# EAGLE design DualExpVCA (EAGLE 9.6.0)
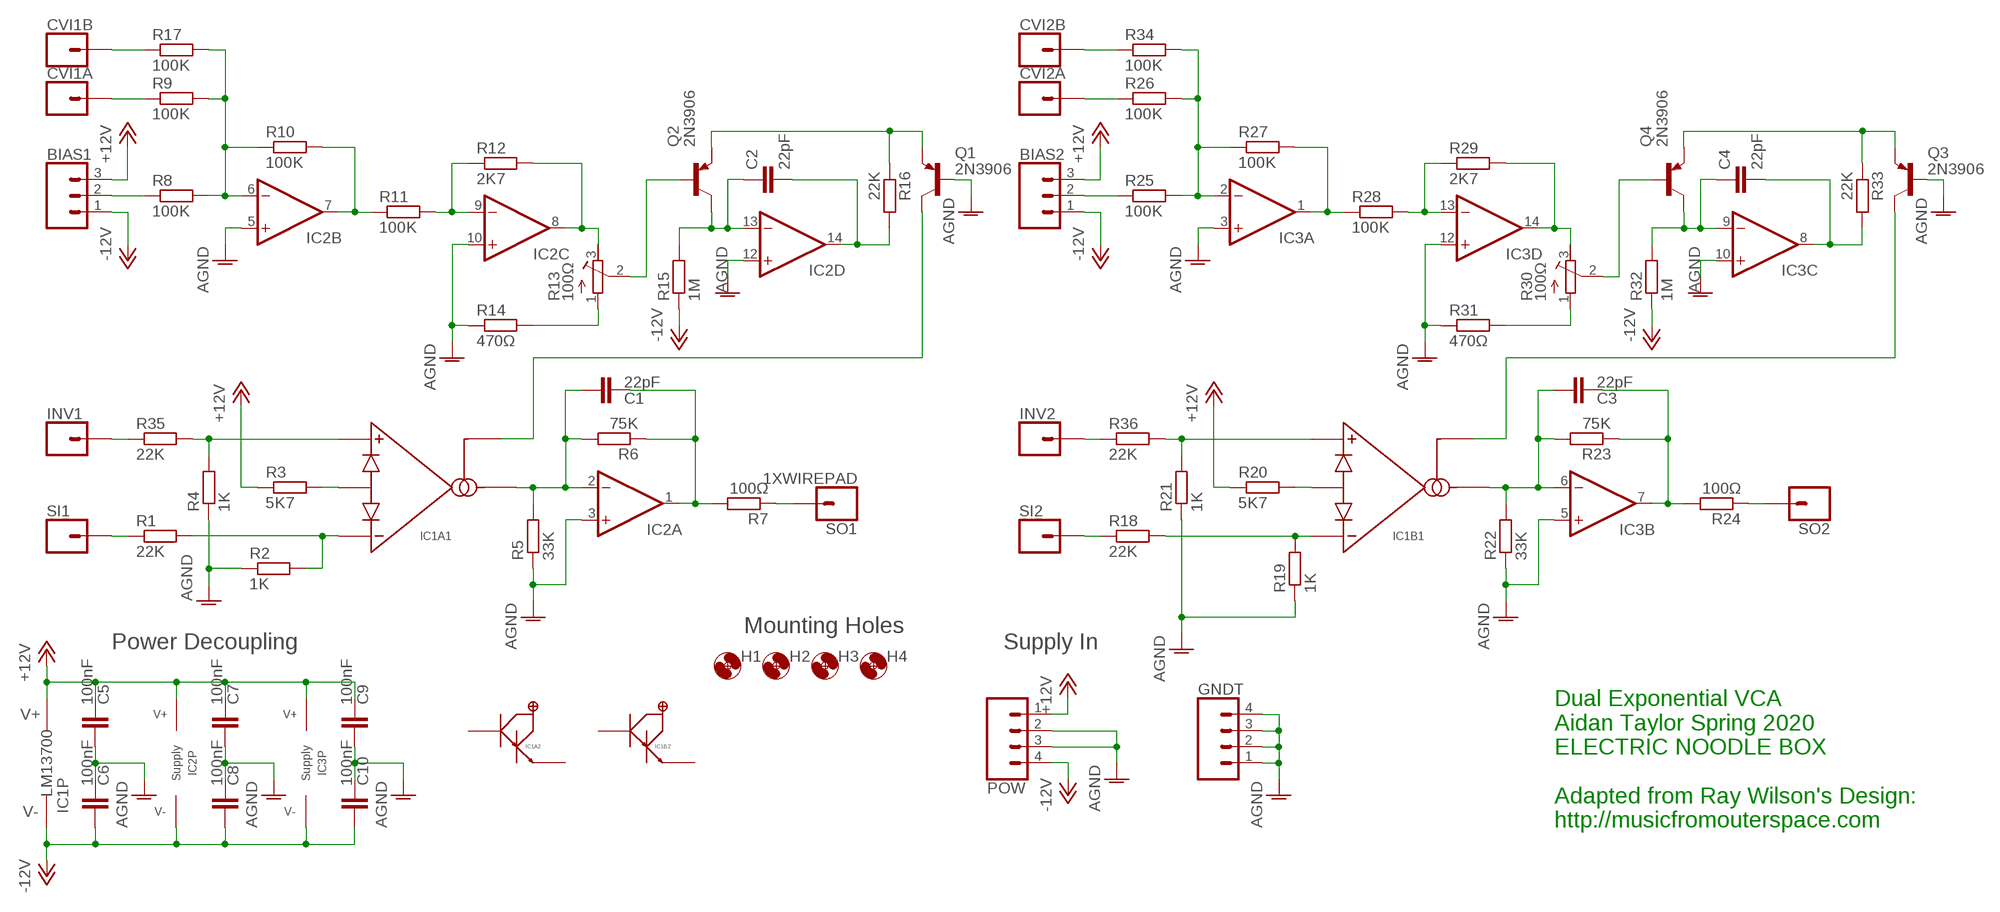
[diagram p0: schematic, sheet 1]

## Parts
BIAS1  3XWIREPAD  [1X03]
BIAS2  3XWIREPAD  [1X03]
C1  22pF  C-EU050-025X075  [C050-025X075]
C2  22pF  C-EU050-025X075  [C050-025X075]
C3  22pF  C-EU050-025X075  [C050-025X075]
C4  22pF  C-EU050-025X075  [C050-025X075]
C5  100nF  C-EU050-025X075  [C050-025X075]
C6  100nF  C-EU050-025X075  [C050-025X075]
C7  100nF  C-EU050-025X075  [C050-025X075]
C8  100nF  C-EU050-025X075  [C050-025X075]
C9  100nF  C-EU050-025X075  [C050-025X075]
C10  100nF  C-EU050-025X075  [C050-025X075]
CVI1A  1XWIREPAD  [1X01]
CVI1B  1XWIREPAD  [1X01]
CVI2A  1XWIREPAD  [1X01]
CVI2B  1XWIREPAD  [1X01]
GNDT  4XWIREPAD  [1X04]
H1  MOUNT-HOLE3.2  [3,2]
H2  MOUNT-HOLE3.2  [3,2]
H3  MOUNT-HOLE3.2  [3,2]
H4  MOUNT-HOLE3.2  [3,2]
IC1  LM13700_DIP  [DIL16]
IC2  TL0X4_DIP  [DIL14]
IC3  TL0X4_DIP  [DIL14]
INV1  1XWIREPAD  [1X01]
INV2  1XWIREPAD  [1X01]
POW  4XMOLEX  [MOLEX-1X4]
Q1  2N3906  [TO92]
Q2  2N3906  [TO92]
Q3  2N3906  [TO92]
Q4  2N3906  [TO92]
R1  22K  R-EU_0207/10  [0207/10]
R2  1K  R-EU_0207/10  [0207/10]
R3  5K7  R-EU_0207/10  [0207/10]
R4  1K  R-EU_0207/10  [0207/10]
R5  33K  R-EU_0207/10  [0207/10]
R6  75K  R-EU_0207/10  [0207/10]
R7  100Ω  R-EU_0207/10  [0207/10]
R8  100K  R-EU_0207/10  [0207/10]
R9  100K  R-EU_0207/10  [0207/10]
R10  100K  R-EU_0207/10  [0207/10]
R11  100K  R-EU_0207/10  [0207/10]
R12  2K7  R-EU_0207/10  [0207/10]
R13  100Ω  R-TRIMM3296W  [RTRIM3296W]
R14  470Ω  R-EU_0207/10  [0207/10]
R15  1M  R-EU_0207/10  [0207/10]
R16  22K  R-EU_0207/10  [0207/10]
R17  100K  R-EU_0207/10  [0207/10]
R18  22K  R-EU_0207/10  [0207/10]
R19  1K  R-EU_0207/10  [0207/10]
R20  5K7  R-EU_0207/10  [0207/10]
R21  1K  R-EU_0207/10  [0207/10]
R22  33K  R-EU_0207/10  [0207/10]
R23  75K  R-EU_0207/10  [0207/10]
R24  100Ω  R-EU_0207/10  [0207/10]
R25  100K  R-EU_0207/10  [0207/10]
R26  100K  R-EU_0207/10  [0207/10]
R27  100K  R-EU_0207/10  [0207/10]
R28  100K  R-EU_0207/10  [0207/10]
R29  2K7  R-EU_0207/10  [0207/10]
R30  100Ω  R-TRIMM3296W  [RTRIM3296W]
R31  470Ω  R-EU_0207/10  [0207/10]
R32  1M  R-EU_0207/10  [0207/10]
R33  22K  R-EU_0207/10  [0207/10]
R34  100K  R-EU_0207/10  [0207/10]
R35  22K  R-EU_0207/10  [0207/10]
R36  22K  R-EU_0207/10  [0207/10]
SI1  1XWIREPAD  [1X01]
SI2  1XWIREPAD  [1X01]
SO1  1XWIREPAD  [1X01]
SO2  1XWIREPAD  [1X01]

## Nets
+12V: BIAS1.3 BIAS2.3 C5.2 C7.2 C9.2 IC1.11(P:V+) IC2.4(P:V+) IC3.4(P:V+) POW.1 R3.1 R20.1
-12V: BIAS1.1 BIAS2.1 C6.1 C8.1 C10.1 IC1.6(P:V-) IC2.11(P:V-) IC3.11(P:V-) POW.4 R15.1 R32.1
AGND: C5.1 C6.2 C7.1 C8.2 C9.1 C10.2 GNDT.1 GNDT.2 GNDT.3 GNDT.4 IC2.3(A:+IN) IC2.5(B:+IN) IC2.10(C:+IN) IC2.12(D:+IN) IC3.3(A:+IN) IC3.5(B:+IN) IC3.10(C:+IN) IC3.12(D:+IN) POW.2 POW.3 Q1.2(B) Q3.2(B) R2.1 R4.1 R5.1 R14.1 R19.1 R21.1 R22.1 R31.1
N$1: R1.1 SI1.1
N$2: IC1.3(A1:AMP+) R4.2 R35.2
N$3: BIAS1.2 R8.1
N$4: IC1.4(A1:AMP-) R1.2 R2.2
N$5: IC1.2(A1:DIODES) R3.2
N$6: R7.1 SO1.1
N$7: C1.1 IC1.5(A1:AMPOUT) IC2.2(A:-IN) R5.2 R6.2
N$8: C1.2 IC2.1(A:OUT) R6.1 R7.2
N$9: CVI1A.1 R9.1
N$10: IC2.6(B:-IN) R8.2 R9.2 R10.1 R17.2
N$11: IC2.7(B:OUT) R10.2 R11.1
N$12: IC2.9(C:-IN) R11.2 R12.1
N$13: IC2.8(C:OUT) R12.2 R13.3(E)
N$14: R13.1(A) R14.2
N$15: Q2.2(B) R13.2(S)
N$16: C2.1 IC2.13(D:-IN) Q2.1(C) R15.2
N$17: Q1.3(E) Q2.3(E) R16.1
N$18: C2.2 IC2.14(D:OUT) R16.2
N$19: CVI1B.1 R17.1
N$20: IC1.1(A1:AMPBIAS) Q1.1(C)
N$21: R18.1 SI2.1
N$22: IC1.14(B1:AMP+) R21.2 R36.2
N$23: IC1.13(B1:AMP-) R18.2 R19.2
N$24: IC1.15(B1:DIODES) R20.2
N$25: C3.1 IC1.12(B1:AMPOUT) IC3.6(B:-IN) R22.2 R23.2
N$26: C3.2 IC3.7(B:OUT) R23.1 R24.2
N$27: R24.1 SO2.1
N$28: BIAS2.2 R25.1
N$29: CVI2A.1 R26.1
N$30: IC3.2(A:-IN) R25.2 R26.2 R27.1 R34.2
N$31: IC3.1(A:OUT) R27.2 R28.1
N$32: IC3.13(D:-IN) R28.2 R29.1
N$33: IC3.14(D:OUT) R29.2 R30.3(E)
N$34: R30.1(A) R31.2
N$35: C4.1 IC3.9(C:-IN) Q4.1(C) R32.2
N$36: C4.2 IC3.8(C:OUT) R33.2
N$37: Q3.3(E) Q4.3(E) R33.1
N$38: IC1.16(B1:AMPBIAS) Q3.1(C)
N$39: Q4.2(B) R30.2(S)
N$40: CVI2B.1 R34.1
N$41: INV1.1 R35.1
N$42: INV2.1 R36.1
Unconnected: IC1.7(A2:BUFF_IN) IC1.8(A2:BUFF_OUT) IC1.9(B2:BUFF_OUT) IC1.10(B2:BUFF_IN)

## Notes on the sheet
- Mounting Holes
- Power Decoupling | Supply In
- Dual Exponential VCA
  Aidan Taylor Spring 2020
  ELECTRIC NOODLE BOX
  
  Adapted from Ray Wilson's Design:
  http://musicfromouterspace.com

## Library data of the parts
BIAS1 BIAS2 = ElectricNoodleBox:3XWIREPAD
C1-C10 = rcl:C-EU: CAPACITOR, European symbol; SPICEPREFIX: C
CVI1A CVI1B CVI2A CVI2B INV1 INV2 SI1 SI2 SO1 SO2 = ElectricNoodleBox:1XWIREPAD
GNDT = ElectricNoodleBox:4XWIREPAD
H1-H4 = holes:MOUNT-HOLE: MOUNTING HOLE with drill center marker
IC1 = ElectricNoodleBox:LM13700_DIP
IC2 IC3 = ElectricNoodleBox:TL0X4_DIP
POW = ElectricNoodleBox:4XMOLEX
Q1-Q4 = transistor-pnp:2N3906: PNP Transistor
R1-R12 R14-R29 R31-R36 = rcl:R-EU_: RESISTOR, European symbol; SPICEPREFIX: R
R13 R30 = rcl:R-TRIMM: Trimm resistor; SPICEMODEL: X; SPICEPREFIXL: POT

## Board
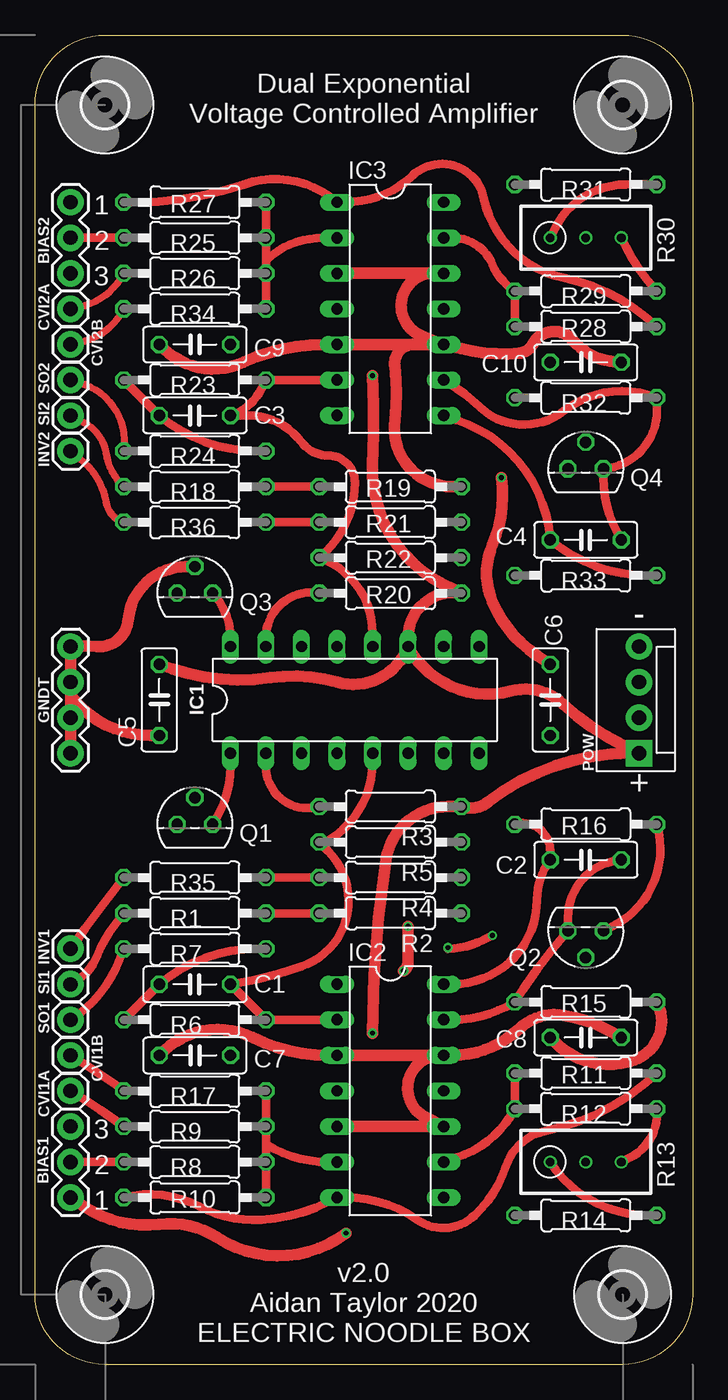
[diagram p1: board, top side]
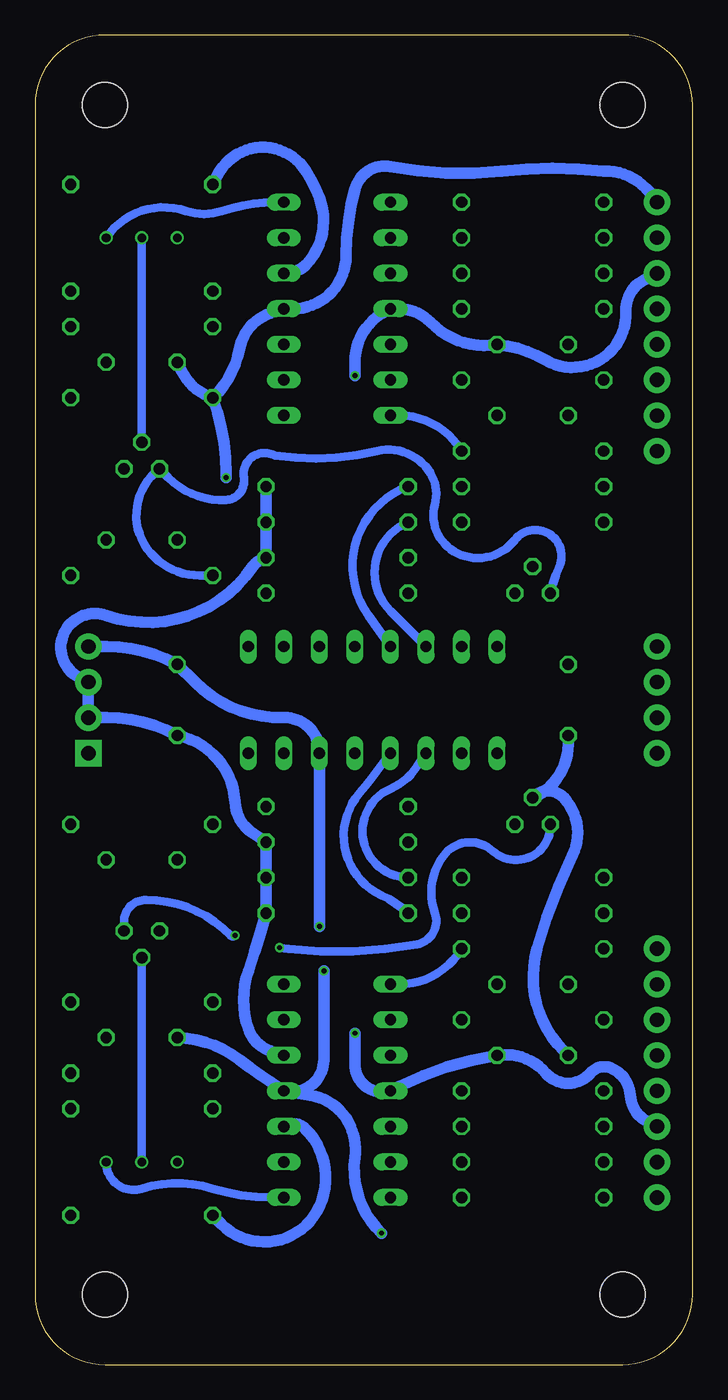
[diagram p2: board, bottom side, seen from below]

Size 47 x 95 mm. Coordinates in mm from the lower left corner, seen from the top.
Outline: 47,90 47,5 arc-90 42,0 5,0 arc-90 0,5 0,90 arc-90 5,95 42,95 arc-90 47,90
Copper layers (1*16): Top 0.035mm / dielectric 1.6mm / Bottom 0.035mm
Design rules "Elecrow_2-layer_PCB_eagle_rule": minimum track width 6mil, minimum drill 12mil, track to track 6mil, track to pad 6mil, pad to pad 6mil, via to via 8mil, smd to smd 0mil, copper to edge 20mil, drill to drill 10mil, minimum pad ring 6mil, minimum via ring 6mil, stop-mask expansion 0mil, vias tented up to drill 100mil, thermal gap 10mil

### Footprints (pad centres in the part's own frame; a part is rotated, then mirrored left to right if it is on the bottom)
1X03 = drill 1.016 pad 1.88: 1 0,0; 2 2.54,0; 3 5.08,0
C050-025X075 = drill 0.813 octagon: 1 -2.54,0; 2 2.54,0
1X01 = drill 1.016 pad 1.88: 1 0,0
1X04 = drill 1.016 pad 1.88: 1 0,0; 2 2.54,0; 3 5.08,0; 4 7.62,0
3,2 = hole 3.2: 0,0
DIL16 = drill 0.813 long: 1 -8.89,-3.81; 2 -6.35,-3.81; 3 -3.81,-3.81; 4 -1.27,-3.81; 5 1.27,-3.81; 6 3.81,-3.81; 7 6.35,-3.81; 8 8.89,-3.81; 9 8.89,3.81; 10 6.35,3.81; 11 3.81,3.81; 12 1.27,3.81; 13 -1.27,3.81; 14 -3.81,3.81; 15 -6.35,3.81; 16 -8.89,3.81
DIL14 = drill 0.813 long: 1 -7.62,-3.81; 2 -5.08,-3.81; 3 -2.54,-3.81; 4 0,-3.81; 5 2.54,-3.81; 6 5.08,-3.81; 7 7.62,-3.81; 8 7.62,3.81; 9 5.08,3.81; 10 2.54,3.81; 11 0,3.81; 12 -2.54,3.81; 13 -5.08,3.81; 14 -7.62,3.81
MOLEX-1X4 = drill 1.016 pad 1.88 square: 1 0,0 | drill 1.016 pad 1.88: 2 2.54,0; 3 5.08,0; 4 7.62,0
TO92 = drill 0.813 octagon: 1 1.27,0; 2 0,1.905; 3 -1.27,0
0207/10 = drill 0.813 octagon: 1 -5.08,0; 2 5.08,0
RTRIM3296W = drill 0.61: 1 0,-2.54; 2 0,0; 3 0,2.54

### Placement (x,y rotation side)
BIAS1  2.54,11.93 90 top
BIAS2  2.54,83.05 270 top
C1  11.43,27.17 180 top
C2  39.37,36.06 180 top
C3  11.43,67.81 180 top
C4  39.37,58.92 180 top
C5  8.89,47.49 90 top
C6  36.83,47.49 270 top
C7  11.43,22.09 0 top
C8  39.37,23.36 0 top
C9  11.43,72.89 0 top
C10  39.37,71.62 0 top
CVI1A  2.54,19.55 0 top
CVI1B  2.54,22.09 0 top
CVI2A  2.54,75.43 0 top
CVI2B  2.54,72.89 0 top
GNDT  2.54,43.68 90 top
H1  42,5 0 top
H2  5,5 0 top
H3  42,90 0 top
H4  5,90 0 top
IC1  22.86,47.49 0 top
IC2  25.4,19.55 270 top
IC3  25.4,75.43 270 top
INV1  2.54,29.71 0 top
INV2  2.54,65.27 0 top
POW  43.18,43.68 90 top
Q1  11.43,38.6 0 top
Q2  39.37,30.98 180 top
Q3  11.43,55.11 0 top
Q4  39.37,64 0 top
R1  11.43,32.25 0 top
R2  25.4,32.25 180 top
R3  25.4,39.87 180 top
R4  25.4,34.79 180 top
R5  25.4,37.33 180 top
R6  11.43,24.63 0 top
R7  11.43,29.71 0 top
R8  11.43,14.47 0 top
R9  11.43,17.01 0 top
R10  11.43,11.93 180 top
R11  39.37,20.82 180 top
R12  39.37,18.28 0 top
R13  39.37,14.47 270 top
R14  39.37,10.66 0 top
R15  39.37,25.9 180 top
R16  39.37,38.6 180 top
R17  11.43,19.55 0 top
R18  11.43,62.73 0 top
R19  25.4,62.73 180 top
R20  25.4,55.11 180 top
R21  25.4,60.19 180 top
R22  25.4,57.65 180 top
R23  11.43,70.35 0 top
R24  11.43,65.27 0 top
R25  11.43,80.51 0 top
R26  11.43,77.97 0 top
R27  11.43,83.05 180 top
R28  39.37,74.16 180 top
R29  39.37,76.7 0 top
R30  39.37,80.51 270 top
R31  39.37,84.32 0 top
R32  39.37,69.08 0 top
R33  39.37,56.38 0 top
R34  11.43,75.43 0 top
R35  11.43,34.79 0 top
R36  11.43,60.19 0 top
SI1  2.54,27.17 0 top
SI2  2.54,67.81 0 top
SO1  2.54,24.63 0 top
SO2  2.54,70.35 0 top

### Tracks (layer width: path | path; a pad name or v marks a point on that pad's centre or on a via)
+12V  (via drill 0.35)
  Top 0.813: v24.13,23.68 arc-9 25.08,36.06 arc-81 29.53,39.87 R3.1 arc57 32.38,40.19 arc-38 42.55,43.68 POW.1 41.91,44.31 arc-16 37.78,47.17 arc58 33.97,48.12 arc-77 IC1.11 | C5.2 9.84,49.71 arc26 16.83,49.08 arc-24 21.59,48.76 arc84 IC1.11 | IC1.11 26.67,51.94 arc-100 R20.1 29.21,55.74 arc-66 24.13,64.32 arc4 v24.13,70.67
  Bottom 0.813: v24.13,23.68 24.13,21.45 arc-106 IC2.4 20.95,19.87 arc18 C7.2 arc58 10.48,20.82 arc-98 7.3,20.82 arc76 5.71,21.14 arc59 4.45,19.23 arc-59 3.17,17.33 BIAS1.3 | v24.13,70.67 24.13,71.62 arc67 IC3.4 20.95,75.43 arc46 18.73,74.48 arc-56 C9.2 arc24 10.48,71.75 arc-123 4.76,75.25 arc65 3.49,77.47 BIAS2.3
-12V  (via drill 0.35)
  Top 0.813: v22.23,9.39 arc-70 13.02,9.07 arc40 8.89,10.03 arc-41 3.49,11.29 BIAS1.1 | v26.67,31.3 26.67,28.76 arc-53 v26.35,28.12 | C6.1 35.88,50.66 arc-33 32.7,54.48 arc-47 32.7,58.6 arc31 v33.34,63.37 | C8.1 37.15,23.04 arc65 42.86,21.77 arc98 R15.1
  Bottom 0.813: IC2.11 arc-104 26.35,21.77 v26.35,28.12 | v26.67,31.3 IC1.6 arc-93 29.21,46.22 arc46 35.56,48.76 C6.1 arc-28 41.91,51.3 POW.4 | IC2.11 27.3,19.23 arc57 24.45,17.01 arc31 24.13,14.79 arc-54 v22.23,9.39 | R32.1 arc-36 32.38,72.57 arc61 30.16,75.11 IC3.11 28.57,75.43 arc-90 24.77,79.24 arc15 24.13,84 arc86 21.59,85.59 arc-17 13.65,85.27 arc12 6.35,85.27 arc56 2.86,83.5 BIAS2.1 | C10.1 36.51,70.98 arc-46 R32.1 | v33.34,63.37 33.34,63.68 arc-20 R32.1 | IC2.11 30.16,20.18 arc4 32.38,21.77 arc-35 C8.1
AGND
  Top 0.813: IC2.12 IC2.3 20.95,22.09 arc-26 15.56,23.36 arc75 C7.1 | IC2.5 IC2.10 27.94,17.64 arc-159 IC2.12 | 2.54,47.81 GNDT.3 GNDT.4 arc-8 4.45,51.3 arc90 6.67,53.2 arc-85 10.79,57.02 Q3.2 | 2.54,47.81 GNDT.2 GNDT.1 | C5.1 8.26,44.95 arc-53 2.54,47.81 | C9.1 arc74 14.92,71.62 arc-25 20.64,72.89 IC3.5 27.3,72.89 | 27.3,72.89 IC3.10 | IC3.3 28.57,77.97 | IC3.12 28.57,77.97 | IC3.10 27.62,73.53 arc-161 28.57,77.97 | IC3.10 30.48,72.57 arc19 34.61,72.25 arc57 35.56,72.89 arc-112 38.42,73.21 arc50 C10.2 | R19.1 29.84,62.73 arc-98 25.72,67.49 arc16 25.72,71.3 arc-106 27.3,72.89 | IC2.12 29.84,22.09 arc44 34.61,24 arc-54 37.78,24.95 arc-22 C8.2
  Bottom 0.813: C7.1 9.21,22.41 arc61 11.11,29.71 arc10 8.57,36.38 arc-69 9.21,40.51 arc-93 Q1.2 arc-67 8.89,44.31 C5.1 | R19.1 R21.1 R22.1 arc-45 31.43,57.02 arc75 41.91,53.52 arc-54 44.13,53.2 arc-118 43.81,49.08 POW.3 POW.2 41.91,46.22 arc28 C6.2 arc75 32.7,40.19 arc-53 31.43,37.97 R5.1 R4.1 R2.1 arc3 31.75,28.12 arc-37 31.75,24 arc-53 30.16,22.41 IC2.12 | R31.1 33.97,84.95 arc121 27.62,85.27 arc11 26.67,83.37 arc64 27.62,78.61 arc49 IC3.12 | R14.1 33.66,10.03 arc-111 26.67,11.29 arc-69 27.68,16.86 arc-78 IC2.10
N$1
  Top 0.61: R1.1 5.71,31.43 arc16 4.45,29.21 arc-43 SI1.1
N$2
  Top 0.61: R35.2 R4.2
  Bottom 0.61: IC1.3 19.68,42.73 arc33 21.59,41.14 arc-156 R4.2
N$3
  Top 0.61: BIAS1.2 R8.1
N$4
  Top 0.61: R1.2 R2.2
  Bottom 0.61: IC1.4 22.54,42.41 arc4 23.81,40.82 arc-105 22.23,33.52 arc17 R2.2
N$5
  Top 0.61: IC1.2 16.51,42.73 arc106 R3.2
N$6
  Top 0.61: R7.1 6.03,28.89 arc-36 SO1.1
N$7
  Top 0.61: R5.2 20.48,37.17 | 20.48,37.17 20.95,36.7 arc-116 19.05,28.44 arc-10 C1.1 R6.2 IC2.2 | IC1.5 24.13,43.05 arc-64 20.48,37.17
N$8
  Top 0.61: R7.2 15.88,29.71 arc40 C1.2 R6.1
  Bottom 0.61: IC2.1 20.95,27.17 arc-59 R7.2
N$9
  Top 0.61: R9.1 5.71,17.46 arc4 CVI1A.1
N$10
  Top 0.61: R17.2 R9.2 16.51,15.74 | 16.51,15.74 R8.2 R10.1 | IC2.6 20.95,14.47 arc-32 16.51,15.74
N$11
  Top 0.61: R10.2 arc-42 11.75,11.29 arc31 16.19,10.34 arc23 20.95,11.61 IC2.7 22.23,11.93 arc-35 27.3,10.34 arc78 31.43,10.66 arc28 33.66,14.15 arc-60 36.51,16.69 arc32 R11.1
N$12
  Top 0.61: IC2.9 30.16,14.79 arc44 R12.1 R11.2
N$13
  Top 0.61: R13.3 42.55,14.79 arc70 R12.2
  Bottom 0.61: IC2.8 30.16,11.93 arc17 34.29,12.56 arc-35 39.37,12.56 arc109 R13.3
N$14
  Top 0.61: R14.2 43.81,10.66 arc-57 R13.1
N$15
  Bottom 0.61: R13.2 Q2.2
N$16
  Top 0.61: IC2.13 29.84,24.63 arc32 R15.2 34.92,26.85 arc-8 Q2.1 38.1,31.93 arc-85 C2.1
N$17  (via drill 0.35)
  Top 0.61: Q2.3 41.27,31.3 arc80 R16.1 | v32.7,30.66 32.07,30.34 arc-25 29.53,29.71 arc-155 v29.51,29.79
  Bottom 0.61: Q2.3 40.64,31.61 arc90 39.05,33.2 arc46 33.02,30.66 arc-91 v32.7,30.66 | v29.51,29.79 28.89,29.71 arc-18 19.68,30.03 arc-99 18.41,32.25 arc57 17.78,36.38 arc95 14.29,36.7 arc-134 Q1.3
N$18
  Top 0.61: IC2.14 29.84,27.17 arc90 35.88,33.2 arc-37 C2.2 36.83,36.7 arc106 R16.2
N$19
  Top 0.61: R17.1 5.71,20 arc4 CVI1B.1
N$20
  Top 0.61: IC1.1 13.97,42.73 arc-34 Q1.1
N$21
  Top 0.508: SI2.1 3.49,67.31 arc-54 5.08,65.09 arc39 R18.1
N$22
  Top 0.61: R36.2 R21.2
  Bottom 0.61: R21.2 arc-113 21.59,53.84 IC1.14
N$23
  Top 0.61: R18.2 R19.2
  Bottom 0.61: IC1.13 23.18,53.52 arc106 R19.2
N$24
  Top 0.61: IC1.15 16.51,51.94 arc-100 R20.2
N$25
  Top 0.61: IC1.12 24.13,52.25 arc70 R22.2 arc50 22.86,63.05 arc90 20.95,64.95 arc-53 19.05,65.91 arc53 15.24,67.81 C3.1 arc46 16.19,69.72 R23.2 IC3.6
N$26
  Top 0.61: R24.2 15.88,65.27 arc-40 C3.2 R23.1
  Bottom 0.61: IC3.7 20.95,67.81 arc59 R24.2
N$27
  Top 0.508: SO2.1 3.17,70.17 arc-82 R24.1
N$28
  Top 0.61: BIAS2.2 R25.1
N$29
  Top 0.508: CVI2A.1 3.17,75.56 arc50 R26.1
N$30
  Top 0.61: R34.2 R26.2 16.51,78.92 | 16.51,78.92 R25.2 R27.1 | IC3.2 20.64,80.51 arc42 16.51,78.92
N$31
  Top 0.61: R27.2 7.3,83.05 arc19 14.92,84.32 arc-59 IC3.1 22.23,83.05 arc44 26.99,84.95 arc-122 32.07,83.37 arc67 37.78,77.65 arc-32 R28.1
N$32
  Top 0.61: IC3.13 29.84,80.51 arc-67 32.7,78.61 arc34 R29.1 R28.2
N$33
  Top 0.61: R30.3 42.23,79.88 arc17 R29.2
  Bottom 0.61: IC3.14 29.84,83.05 arc-19 33.66,82.42 arc38 36.2,82.42 arc-75 R30.3
N$34
  Top 0.61: R30.1 37.15,81.14 arc-63 42.23,84.32 arc-1 R31.2
N$35
  Top 0.61: C4.1 arc-32 40.64,63.37 Q4.1 arc85 44.45,68.13 R32.2 arc59 37.78,68.13 arc-42 34.61,67.17 arc-39 31.75,68.44 arc10 30.16,69.72 IC3.9
N$36
  Top 0.61: IC3.8 30.16,67.49 arc-67 C4.2 arc40 43.81,56.38 R33.2
N$37
  Bottom 0.61: R33.1 35.24,56.38 arc49 38.73,57.97 arc94 Q4.3 37.47,63.37 arc-48 33.34,61.78 arc-97 32.07,63.37 arc128 29.84,64.95 arc-22 22.54,65.27 arc72 18.73,63.68 arc46 18.41,61.46 arc-79 16.83,57.97 arc-78 12.7,58.92 arc166 9.53,57.02 arc-11 Q3.3
N$38
  Top 0.61: IC1.16 13.97,51.94 arc44 Q3.1
N$39
  Bottom 0.61: R30.2 Q4.2
N$40
  Top 0.508: CVI2B.1 3.17,73.03 arc50 R34.1
N$41
  Top 0.61: R35.1 5.71,33.97 arc2 INV1.1
N$42
  Top 0.508: INV2.1 3.17,64.77 arc-42 5.08,61.59 arc64 R36.1

### Text on the board
tPlace: Dual Exponential / Voltage Controlled Amplifier | 1 | 2 | 3 | - | + | 3 | 2 | 1 | v2.0 / Aidan Taylor 2020 / ELECTRIC NOODLE BOX